# Altium project PCB_Project.PrjPcb
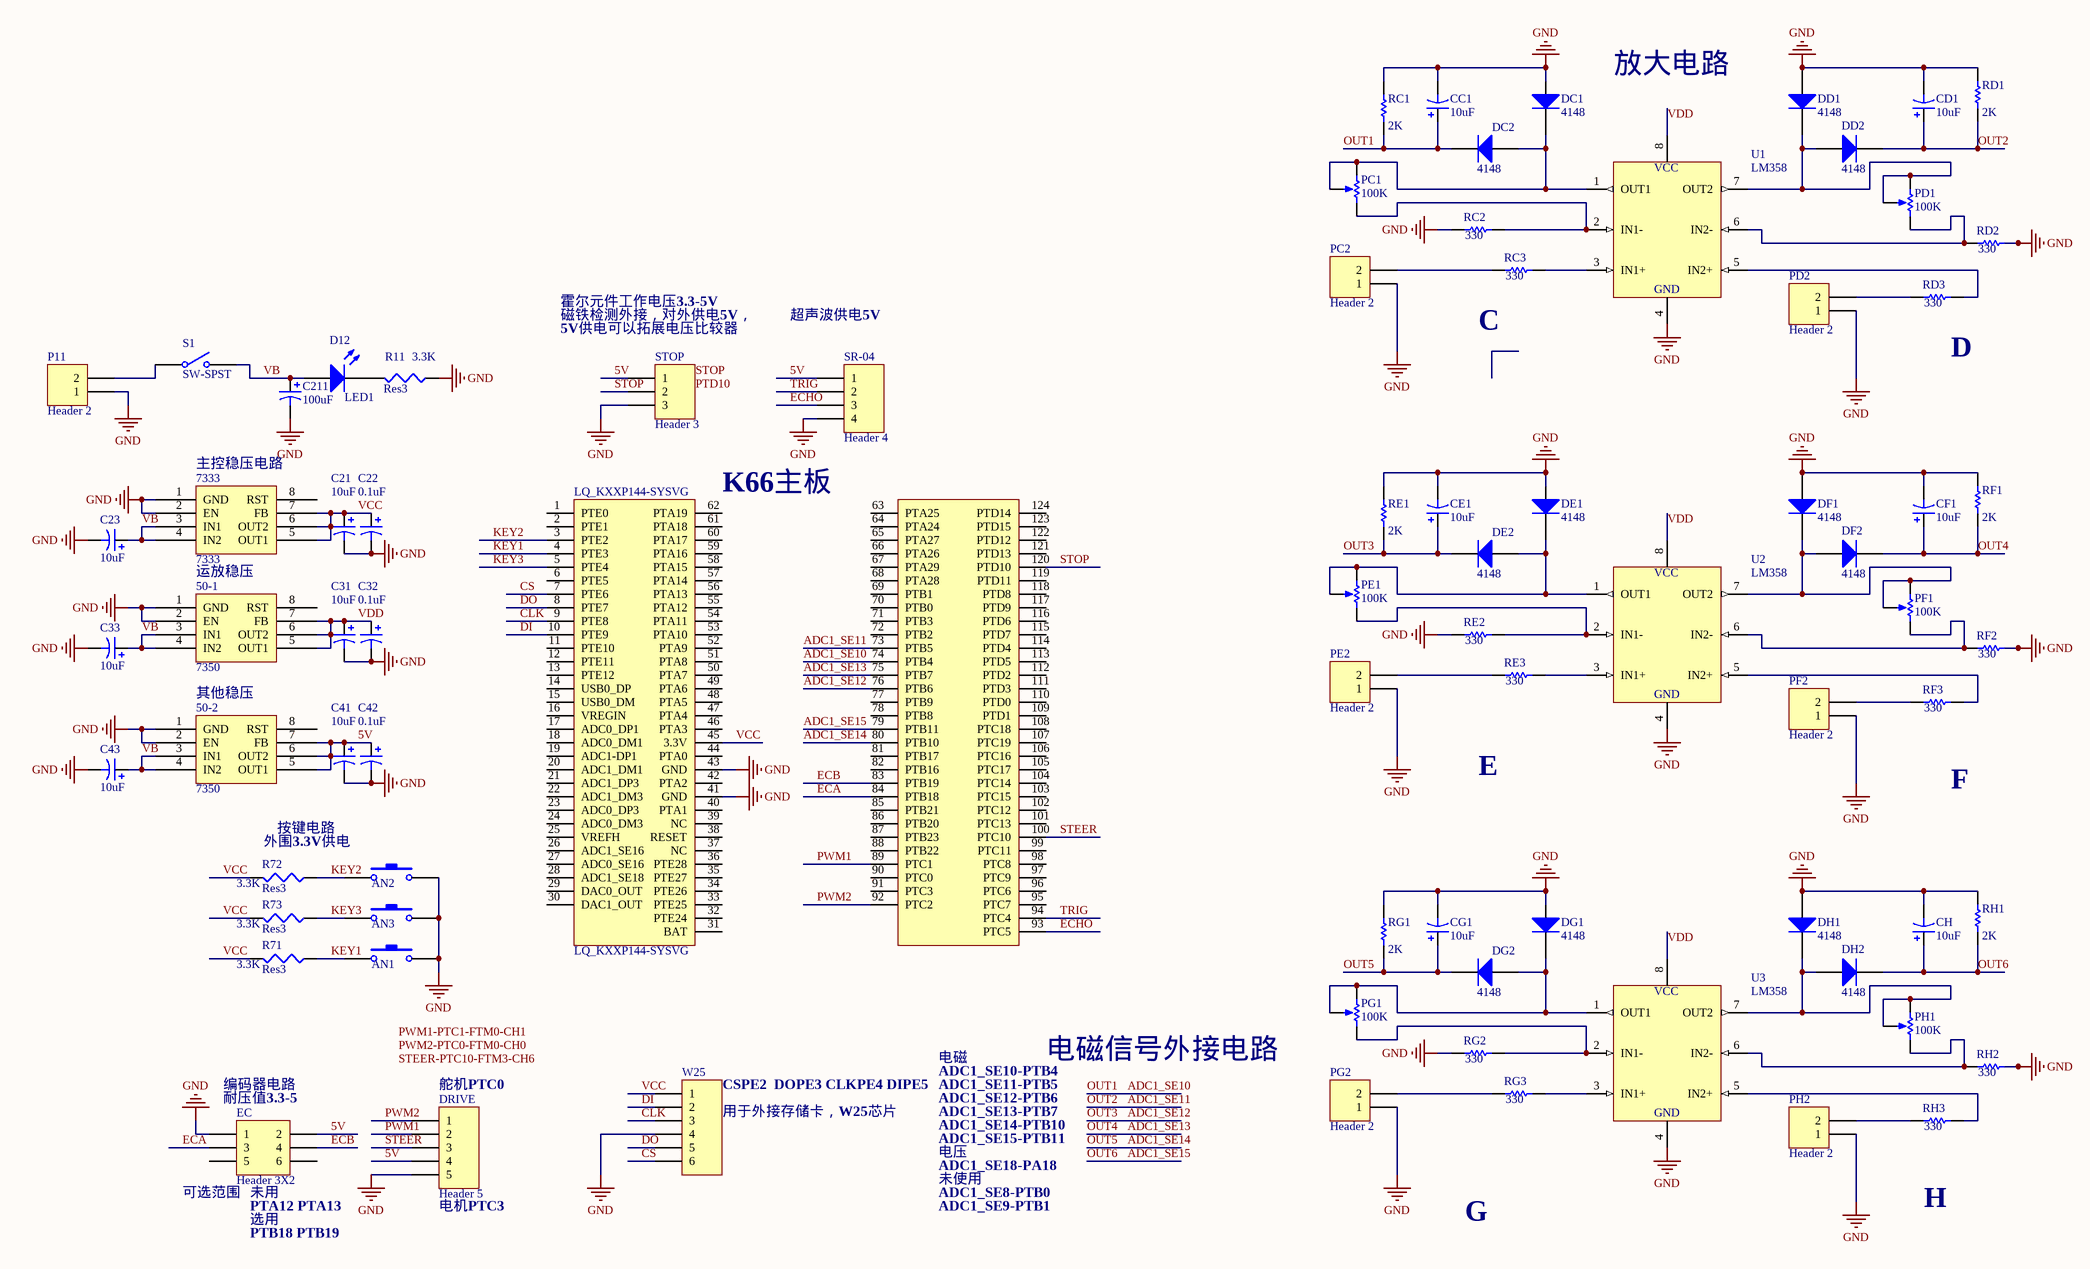
[diagram p0: Sheet.SchDoc]
1 sheet, 80 parts. Net scope: global (net labels, ports and power ports of the same name join across sheets).
Board files: PCB.PcbDoc, PCB1.PcbDoc

## Sheet Sheet.SchDoc
size A2

### Parts
50-1  7350  [SOP8_N]
50-2  7350  [SOP8_N]
7333  7333  [SO8_N]
AN1  Button  [SMT4*6*2.5]  (value not drawn)
AN2  Button  [SMT4*6*2.5]  (value not drawn)
AN3  Button  [SMT4*6*2.5]  (value not drawn)
C21  value 10uF  [C6032]  (hidden comment: Cap Pol3)
C22  value 0.1uF  [C3216]  (hidden comment: Cap Pol3)
C23  value 10uF  [C6032]  (hidden comment: Cap Pol3)
C31  value 10uF  [C6032]  (hidden comment: Cap Pol3)
C32  value 0.1uF  [C3216]  (hidden comment: Cap Pol3)
C33  value 10uF  [C6032]  (hidden comment: Cap Pol3)
C41  value 10uF  [C6032]  (hidden comment: Cap Pol3)
C42  value 0.1uF  [C3216]  (hidden comment: Cap Pol3)
C43  value 10uF  [C6032]  (hidden comment: Cap Pol3)
C211  value 100uF  [C7343]  (hidden comment: Cap Pol3)
CC1  value 10uF  [C6032]  (hidden comment: Cap Pol3)
CD1  value 10uF  [C6032]  (hidden comment: Cap Pol3)
CE1  value 10uF  [C6032]  (hidden comment: Cap Pol3)
CF1  value 10uF  [C6032]  (hidden comment: Cap Pol3)
CG1  value 10uF  [C6032]  (hidden comment: Cap Pol3)
CH  value 10uF  [C6032]  (hidden comment: Cap Pol3)
D12  LED1  [SMA]
DC1  4148  [SMA]
DC2  4148  [SMA]
DD1  4148  [SMA]
DD2  4148  [SMA]
DE1  4148  [SMA]
DE2  4148  [SMA]
DF1  4148  [SMA]
DF2  4148  [SMA]
DG1  4148  [SMA]
DG2  4148  [SMA]
DH1  4148  [SMA]
DH2  4148  [SMA]
DRIVE  Header 5  [HX2.54-5]
EC  Header 3X2  [HDR2X3]
LQ_KXXP144-SYSVG  LQ_KXXP144-SYSVG  [LQ_KXXP144-SYSVG]
P11  Header 2  [2PIN-5.08B]
PC1  value 100K  [VR_B1]  (hidden comment: RPot)
PC2  Header 2  [HX2.54-2]
PD1  value 100K  [VR_B1]  (hidden comment: RPot)
PD2  Header 2  [HX2.54-2]
PE1  value 100K  [VR_B1]  (hidden comment: RPot)
PE2  Header 2  [HX2.54-2]
PF1  value 100K  [VR_B1]  (hidden comment: RPot)
PF2  Header 2  [HX2.54-2]
PG1  value 100K  [VR_B1]  (hidden comment: RPot)
PG2  Header 2  [HX2.54-2]
PH1  value 100K  [VR_B1]  (hidden comment: RPot)
PH2  Header 2  [HX2.54-2]
R11  Res3  value 3.3K  [R0805]
R71  Res3  value 3.3K  [R0805]
R72  Res3  value 3.3K  [R0805]
R73  Res3  value 3.3K  [R0805]
RC1  value 2K  [C0805]  (hidden comment: Res Semi)
RC2  value 330  [C0805]  (hidden comment: Res Semi)
RC3  value 330  [C0805]  (hidden comment: Res Semi)
RD1  value 2K  [C0805]  (hidden comment: Res Semi)
RD2  value 330  [C0805]  (hidden comment: Res Semi)
RD3  value 330  [C0805]  (hidden comment: Res Semi)
RE1  value 2K  [C0805]  (hidden comment: Res Semi)
RE2  value 330  [C0805]  (hidden comment: Res Semi)
RE3  value 330  [C0805]  (hidden comment: Res Semi)
RF1  value 2K  [C0805]  (hidden comment: Res Semi)
RF2  value 330  [C0805]  (hidden comment: Res Semi)
RF3  value 330  [C0805]  (hidden comment: Res Semi)
RG1  value 2K  [C0805]  (hidden comment: Res Semi)
RG2  value 330  [C0805]  (hidden comment: Res Semi)
RG3  value 330  [C0805]  (hidden comment: Res Semi)
RH1  value 2K  [C0805]  (hidden comment: Res Semi)
RH2  value 330  [C0805]  (hidden comment: Res Semi)
RH3  value 330  [C0805]  (hidden comment: Res Semi)
S1  SW-SPST  [SW-TO3]
SR-04  Header 4  [HX2.54-4]
STOP  Header 3  [HX2.54-3]
U1  LM358  [SOP8_M]
U2  LM358  [SOP8_M]
U3  LM358  [SOP8_M]
W25  MHDR1X6  [HDR1X6]  (value not drawn)

### Nets
GND: 50-1.1(GND) 50-1.2(EN) 50-2.1(GND) 50-2.2(EN) 7333.1(GND) 7333.2(EN) AN1.1 AN2.1 AN3.1 C21.2 C22.2 C23.2 C31.2 C32.2 C33.2 C41.2 C42.2 C43.2 C211.2 CC1.2 CD1.2 CE1.2 CF1.2 CG1.2 CH.2 DC1.1(A) DD1.1(A) DE1.1(A) DF1.1(A) DG1.1(A) DH1.1(A) DRIVE.5 EC.1 LQ_KXXP144-SYSVG.41(GND) LQ_KXXP144-SYSVG.43(GND) P11.1 PC2.1 PD2.1 PE2.1 PF2.1 PG2.1 PH2.1 R11.1 RC1.2 RC2.1 RD1.2 RD2.2 RE1.2 RE2.1 RF1.2 RF2.2 RG1.2 RG2.1 RH1.2 RH2.2 SR-04.4 STOP.3 U1.4(GND) U2.4(GND) U3.4(GND) W25.4
5V: 50-2.5(OUT1) 50-2.6(OUT2) 50-2.7(FB) C41.1 C42.1 DRIVE.4 EC.2 SR-04.1 STOP.1
ADC1_SE10: CC1.1 DC2.2(K) LQ_KXXP144-SYSVG.74(PTB4) RC1.1  [also labelled OUT1]
ADC1_SE11: CD1.1 DD2.2(K) LQ_KXXP144-SYSVG.73(PTB5) RD1.1  [also labelled OUT2]
ADC1_SE12: CE1.1 DE2.2(K) LQ_KXXP144-SYSVG.76(PTB6) RE1.1  [also labelled OUT3]
ADC1_SE13: CF1.1 DF2.2(K) LQ_KXXP144-SYSVG.75(PTB7) RF1.1  [also labelled OUT4]
ADC1_SE14: CG1.1 DG2.2(K) LQ_KXXP144-SYSVG.80(PTB10) RG1.1  [also labelled OUT5]
ADC1_SE15: CH.1 DH2.2(K) LQ_KXXP144-SYSVG.79(PTB11) RH1.1  [also labelled OUT6]
CLK: LQ_KXXP144-SYSVG.9(PTE8) W25.3
CS: LQ_KXXP144-SYSVG.7(PTE6) W25.6
DI: LQ_KXXP144-SYSVG.10(PTE9) W25.2
DO: LQ_KXXP144-SYSVG.8(PTE7) W25.5
ECA: EC.3 LQ_KXXP144-SYSVG.84(PTB18)
ECB: EC.4 LQ_KXXP144-SYSVG.83(PTB19)
ECHO: LQ_KXXP144-SYSVG.93(PTC5) SR-04.3
KEY1: AN1.2 LQ_KXXP144-SYSVG.4(PTE3) R71.1
KEY2: AN2.2 LQ_KXXP144-SYSVG.3(PTE2) R72.1
KEY3: AN3.2 LQ_KXXP144-SYSVG.5(PTE4) R73.1
PWM1: DRIVE.2 LQ_KXXP144-SYSVG.89(PTC1)
PWM2: DRIVE.1 LQ_KXXP144-SYSVG.92(PTC2)
STEER: DRIVE.3 LQ_KXXP144-SYSVG.100(PTC10)
STOP: LQ_KXXP144-SYSVG.120(PTD10) STOP.2
TRIG: LQ_KXXP144-SYSVG.94(PTC4) SR-04.2
VB: 50-1.3(IN1) 50-1.4(IN2) 50-2.3(IN1) 50-2.4(IN2) 7333.3(IN1) 7333.4(IN2) C23.1 C33.1 C43.1 C211.1 D12.1(A) S1.2(NO)
VCC: 7333.5(OUT1) 7333.6(OUT2) 7333.7(FB) C21.1 C22.1 LQ_KXXP144-SYSVG.45(3.3V) R71.2 R72.2 R73.2 W25.1
VDD: 50-1.5(OUT1) 50-1.6(OUT2) 50-1.7(FB) C31.1 C32.1 U1.8(VCC) U2.8(VCC) U3.8(VCC)
NetD12_2: D12.2(K) R11.2
NetDC1_2: DC1.2(K) DC2.1(A) PC1.1(TOP) PC1.2(TAP) U1.1(OUT1)
NetDD1_2: DD1.2(K) DD2.1(A) PD1.1(TOP) PD1.2(TAP) U1.7(OUT2)
NetDE1_2: DE1.2(K) DE2.1(A) PE1.1(TOP) PE1.2(TAP) U2.1(OUT1)
NetDF1_2: DF1.2(K) DF2.1(A) PF1.1(TOP) PF1.2(TAP) U2.7(OUT2)
NetDG1_2: DG1.2(K) DG2.1(A) PG1.1(TOP) PG1.2(TAP) U3.1(OUT1)
NetDH1_2: DH1.2(K) DH2.1(A) PH1.1(TOP) PH1.2(TAP) U3.7(OUT2)
NetP11_2: P11.2 S1.1(COMMON)
NetPC1_3: PC1.3(BOT) RC2.2 U1.2(IN1-)
NetPC2_2: PC2.2 RC3.1
NetPD1_3: PD1.3(BOT) RD2.1 U1.6(IN2-)
NetPD2_2: PD2.2 RD3.1
NetPE1_3: PE1.3(BOT) RE2.2 U2.2(IN1-)
NetPE2_2: PE2.2 RE3.1
NetPF1_3: PF1.3(BOT) RF2.1 U2.6(IN2-)
NetPF2_2: PF2.2 RF3.1
NetPG1_3: PG1.3(BOT) RG2.2 U3.2(IN1-)
NetPG2_2: PG2.2 RG3.1
NetPH1_3: PH1.3(BOT) RH2.1 U3.6(IN2-)
NetPH2_2: PH2.2 RH3.1
NetRC3_2: RC3.2 U1.3(IN1+)
NetRD3_2: RD3.2 U1.5(IN2+)
NetRE3_2: RE3.2 U2.3(IN1+)
NetRF3_2: RF3.2 U2.5(IN2+)
NetRG3_2: RG3.2 U3.3(IN1+)
NetRH3_2: RH3.2 U3.5(IN2+)

Not connected (* = marked no-connect by the designer): 50-1 8(RST); 50-2 8(RST); 7333 8(RST); EC 5 6; LQ_KXXP144-SYSVG 1(PTE0) 2(PTE1) 6(PTE5) 11(PTE10) 12(PTE11) 13(PTE12) 14(USB0_DP) 15(USB0_DM) 16(VREGIN) 17(ADC0_DP1) 18(ADC0_DM1) 19(ADC1-DP1) 20(ADC1_DM1) 21(ADC1_DP3) 22(ADC1_DM3) 23(ADC0_DP3) 24(ADC0_DM3) 25(VREFH) 26(ADC1_SE16) 27(ADC0_SE16) 28(ADC1_SE18) 29(DAC0_OUT) 30(DAC1_OUT) 31(BAT) 32(PTE24) 33(PTE25) 34(PTE26) 35(PTE27) 36(PTE28) 37(NC) 38(RESET) 39(NC) 40(PTA1) 42(PTA2) 44(PTA0) 46(PTA3) 47(PTA4) 48(PTA5) 49(PTA6) 50(PTA7) 51(PTA8) 52(PTA9) 53(PTA10) 54(PTA11) 55(PTA12) 56(PTA13) 57(PTA14) 58(PTA15) 59(PTA16) 60(PTA17) 61(PTA18) 62(PTA19) 63(PTA25) 64(PTA24) 65(PTA27) 66(PTA26) 67(PTA29) 68(PTA28) 69(PTB1) 70(PTB0) 71(PTB3) 72(PTB2) 77(PTB9) 78(PTB8) 81(PTB17) 82(PTB16) 85(PTB21) 86(PTB20) 87(PTB23) 88(PTB22) 90(PTC0) 91(PTC3) 95(PTC7) 96(PTC6) 97(PTC9) 98(PTC8) 99(PTC11) 101(PTC13) 102(PTC12) 103(PTC15) 104(PTC14) 105(PTC17) 106(PTC16) 107(PTC19) 108(PTC18) 109(PTD1) 110(PTD0) 111(PTD3) 112(PTD2) 113(PTD5) 114(PTD4) 115(PTD7) 116(PTD6) 117(PTD9) 118(PTD8) 119(PTD11) 121(PTD13) 122(PTD12) 123(PTD15) 124(PTD14)

### Notes on the sheet
- 放大电路
- 霍尔元件工作电压3.3-5V
- 磁铁检测外接，对外供电5V，
- (near STOP) 5V供电可以拓展电压比较器
- 超声波供电5V
- (near RC3) C
- (near RD3) D
- (near 7333) 主控稳压电路
- (near LQ_KXXP144-SYSVG) K66主板
- 运放稳压
- 其他稳压
- 按键电路
- E
- F
- (near R72) 外围3.3V供电
- (near EC) 编码器电路
- (near EC) 耐压值3.3-5
- (near DRIVE) 舵机PTC0
- (near W25) CSPE2  DOPE3 CLKPE4 DIPE5
- ADC1_SE10-PTB4
- ADC1_SE11-PTB5
- ADC1_SE12-PTB6
- 电磁
- 电磁信号外接电路
- (near W25) 用于外接存储卡，W25芯片
- ADC1_SE13-PTB7
- ADC1_SE14-PTB10
- ADC1_SE15-PTB11
- ADC1_SE18-PA18
- 电压
- (near EC) 可选范围
- (near EC) PTA12 PTA13
- PTB18 PTB19
- (near EC) 选用
- (near EC) 未用
- (near DRIVE) 电机PTC3
- ADC1_SE8-PTB0
- ADC1_SE9-PTB1
- 未使用
- G
- H
- Labels drawn without touching a wire or pin: PTD10, PWM1-PTC1-FTM0-CH1, PWM2-PTC0-FTM0-CH0, STEER-PTC10-FTM3-CH6, STOP

### Library data of the parts
C21-C23 C31-C33 C41-C43 C211 CC1 CD1 CE1 CF1 CG1 CH = Cap Pol3: Polarized Capacitor (Surface Mount); Published: 8-Jun-2000; LatestRevisionDate: 29-May-2009; LatestRevisionNote: IPC-7351 Footprint Added.; PackageReference: C0805; Publisher: Altium Limited; PackageDescription: Chip Capacitor
D12 = LED3: Typical BLUE SiC LED; Published: 8-Jun-2000; LatestRevisionDate: 17-Dec-2003; LatestRevisionNote: PCB Footprint replaced.; DatasheetVersion: 16-Apr-2002; PackageVersion: 16-Apr-2002; PackageReference: 3.5X2.8X1.9; Publisher: Altium Limited; PackageDescription: SM LED; 2 C-Bend Leads; Body 3.5 x 2.8 x 1.9 mm, inc leads (LxWxH typ)
DC1 DC2 DD1 DD2 DE1 DE2 DF1 DF2 DG1 DG2 DH1 DH2 = Diode: Default Diode; Published: 8-Jun-2000; LatestRevisionDate: 17-Jul-2002; LatestRevisionNote: Re-released for DXP Platform.; PackageVersion: Sep-1996; PackageReference: SMC; Publisher: Altium Limited; Code_JEDEC: DO-214-AB
DRIVE = Header 5: Header, 5-Pin; LatestRevisionDate: 17-Jul-2002; LatestRevisionNote: Re-released for DXP Platform.; Publisher: Altium Limited
EC = Header 3X2: Header, 3-Pin, Dual row; LatestRevisionDate: 17-Jul-2002; LatestRevisionNote: Re-released for DXP Platform.; Publisher: Altium Limited
P11 PC2 PD2 PE2 PF2 PG2 PH2 = Header 2: Header, 2-Pin; LatestRevisionDate: 17-Jul-2002; LatestRevisionNote: Re-released for DXP Platform.; Publisher: Altium Limited
PC1 PD1 PE1 PF1 PG1 PH1 = RPot: 精密可调电阻; Sim Note: Enter the Resistance value and the set point into parameter fields.; Set Position: 0.5; Published: 8-Jun-2000; LatestRevisionDate: 17-Jul-2002; LatestRevisionNote: Re-released for DXP Platform.; PackageReference: VR5; Publisher: Altium Limited
R11 R71-R73 = Res3: Resistor; Published: 8-Jun-2000; LatestRevisionDate: 29-May-2009; LatestRevisionNote: IPC-7351 Footprint Added.; PackageReference: J1-0603; Publisher: Altium Limited; PackageDescription: Chip Resistor
RC1-RC3 RD1-RD3 RE1-RE3 RF1-RF3 RG1-RG3 RH1-RH3 = Res Semi: Semiconductor Resistor; Published: 8-Jun-2000; LatestRevisionDate: 17-Jul-2002; LatestRevisionNote: Re-released for DXP Platform.; PackageReference: AXIAL-0.5; Publisher: Altium Limited
S1 = SW-SPST: Single-Pole, Single-Throw Switch; Published: 24-Mar-1999; Revision: July-2002: Re-released for DXP Platform.; Publisher: Altium Limited
SR-04 = Header 4: Header, 4-Pin; LatestRevisionDate: 17-Jul-2002; LatestRevisionNote: Re-released for DXP Platform.; Publisher: Altium Limited
STOP = Header 3: Header, 3-Pin; LatestRevisionDate: 17-Jul-2002; LatestRevisionNote: Re-released for DXP Platform.; Publisher: Altium Limited
W25 = MHDR1X6: Header, 6-Pin; Revision: 17-Jul-2002: Re-released for DXP Platform.; Publisher: Altium Limited
AN1-AN3 = Button: Published: 24-Mar-1999; LatestRevisionDate: 17-Jul-2002; LatestRevisionNote: Re-released for DXP Platform.; PackageReference: SPST-2; Publisher: Altium Limited